# EAGLE design Display adapter (EAGLE 8.0.0)
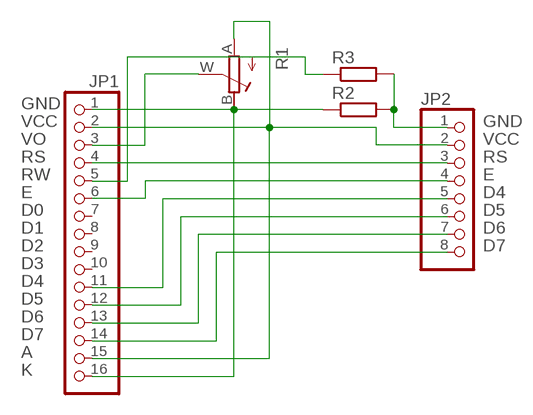
[diagram p0: schematic, sheet 1]

## Parts
JP1  PINHD-1X16  [1X16]
JP2  PINHD-1X8  [1X08]
R1  R_POTTURN-X  [RJ9W]
R2  R_1206  [R1206]
R3  R_1206  [R1206]

## Nets
N$1: JP1.5 R3.1
N$2: JP2.1 R2.2 R3.2
N$4: JP1.11 JP2.5
N$5: JP1.6 JP2.4
N$6: JP1.4 JP2.3
N$7: JP1.1 JP1.16 R1.B(E) R2.1
N$8: JP1.2 JP1.15 JP2.2 R1.A
N$9: JP1.3 R1.W(S)
N$10: JP1.12 JP2.6
N$11: JP1.13 JP2.7
N$12: JP1.14 JP2.8
Unconnected: JP1.7 JP1.8 JP1.9 JP1.10

## Notes on the sheet
- GND
- VCC | GND
- VO | VCC
- RS | RS
- RW | E
- E | D4
- D0 | D5
- D1 | D6
- D2 | D7
- D3
- D4
- D5
- D6
- D7
- A
- K

## Library data of the parts
JP1 = pinhead:PINHD-1X16: PIN HEADER
JP2 = pinhead:PINHD-1X8: PIN HEADER
R1 = Namenlos:R_POT
R2 R3 = Namenlos:R_

## Board
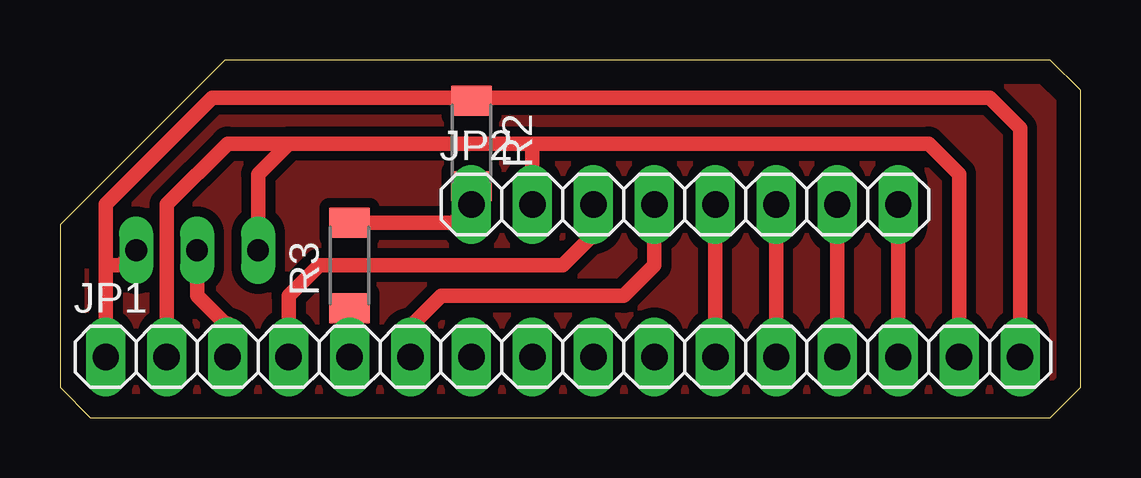
[diagram p1: board, top side]
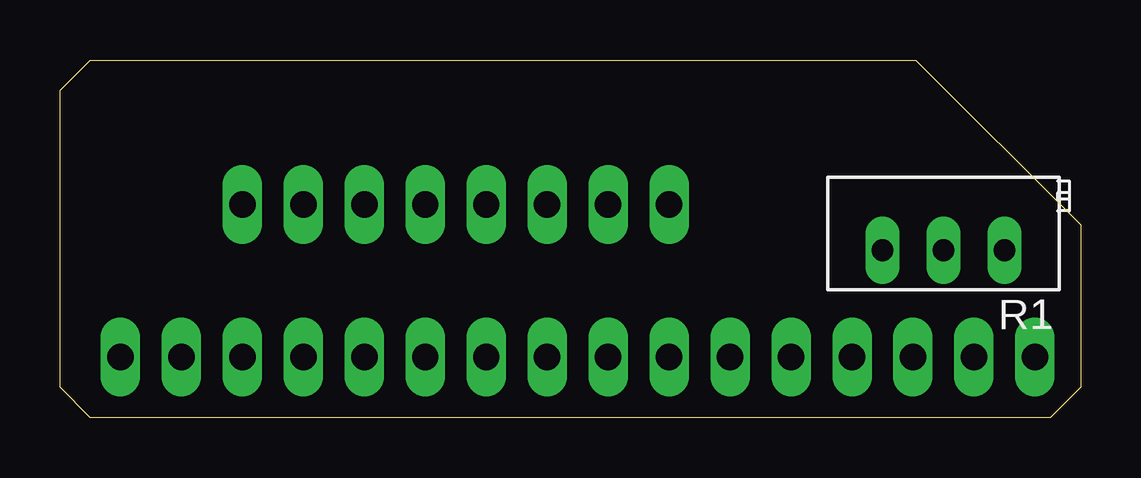
[diagram p2: board, bottom side, seen from below]

Size 42.52 x 14.91 mm. Coordinates in mm from the lower left corner, seen from the top.
Outline: 41.26,14.91 6.87,14.91 0,8.04 0,1.27 1.27,0 41.26,0 42.52,1.27 42.52,13.64 41.26,14.91
Copper layers (1*16): Top 0.035mm / dielectric 1.5mm / Bottom 0.035mm
Design rules "EagleDesignRules": minimum track width 0.2mm, minimum drill 0.3mm, track to track 0.2mm, track to pad 0.2mm, pad to pad 0.2mm, via to via 0.2mm, smd to smd 0.2mm, copper to edge 1mm, drill to drill 0.2mm, minimum pad ring 10mil, minimum via ring 8mil, stop-mask expansion 4mil, vias tented up to drill 0mil, thermal gap 0.25mm

### Footprints (pad centres in the part's own frame; a part is rotated, then mirrored left to right if it is on the bottom)
1X16 = drill 1.1 long: 1 -19.05,0; 2 -16.51,0; 3 -13.97,0; 4 -11.43,0; 5 -8.89,0; 6 -6.35,0; 7 -3.81,0; 8 -1.27,0; 9 1.27,0; 10 3.81,0; 11 6.35,0; 12 8.89,0; 13 11.43,0; 14 13.97,0; 15 16.51,0; 16 19.05,0
1X08 = drill 1.1 long: 1 -8.89,0; 2 -6.35,0; 3 -3.81,0; 4 -1.27,0; 5 1.27,0; 6 3.81,0; 7 6.35,0; 8 8.89,0
RJ9W = drill 0.9 long: A 2.54,0.635; B -2.54,0.635; W 0,0.635
R1206 = smd 1.25 x 1.7: 1 -1.775,0; 2 1.775,0

### Placement (x,y rotation side)
JP1  20.95,2.54 0 top
JP2  26.04,8.89 0 top
R1  5.71,7.62 180 bottom
R2  17.14,11.43 270 top
R3  12.06,6.35 90 top

### Tracks (layer width: path | path; a pad name or v marks a point on that pad's centre or on a via)
N$1
  Top 0.813: JP1.5 R3.1
N$2
  Top 0.61: R3.2 16.38,8.12 JP2.1
  Top 0.813: JP2.1 R2.2
N$3
  pour Top (isolate 0.406): -0.64,7.62 6.99,15.24 41.27,15.24 42.55,13.97 42.55,1.27 41.27,0 0.64,0 -0.64,1.27
N$4
  Top 0.61: JP1.11 JP2.5
N$5
  Top 0.61: JP2.4 24.76,6.35 23.49,5.08 15.88,5.08 14.61,3.81 JP1.6
N$6
  Top 0.61: 22.22,7.62 20.95,6.35 10.79,6.35 9.53,5.08 JP1.4
  Top 0.813: JP2.3 22.22,7.62
N$7
  Top 0.61: 1.91,6.35 1.91,8.89 6.35,13.34 17.14,13.34 38.73,13.34 40.01,12.06 JP1.16 | 1.91,6.35 JP1.1 | R1.B 2.54,6.35 1.91,6.35
  Top 0.813: R2.1 17.14,13.34
N$8
  Top 0.61: R1.A 8.26,10.16 9.53,11.43 | JP1.2 4.45,8.89 6.99,11.43 9.53,11.43 | JP1.15 37.47,10.16 36.2,11.43 19.68,11.43 | 19.68,11.43 9.53,11.43 | JP2.2 19.68,11.43
N$9
  Top 0.61: R1.W 5.71,5.08 6.99,3.81
  Top 0.813: 6.99,3.81 JP1.3
N$10
  Top 0.61: JP1.12 JP2.6
N$11
  Top 0.61: JP1.13 JP2.7
N$12
  Top 0.61: JP1.14 JP2.8